# Altium schematic sheet Ports.SchDoc
size A4
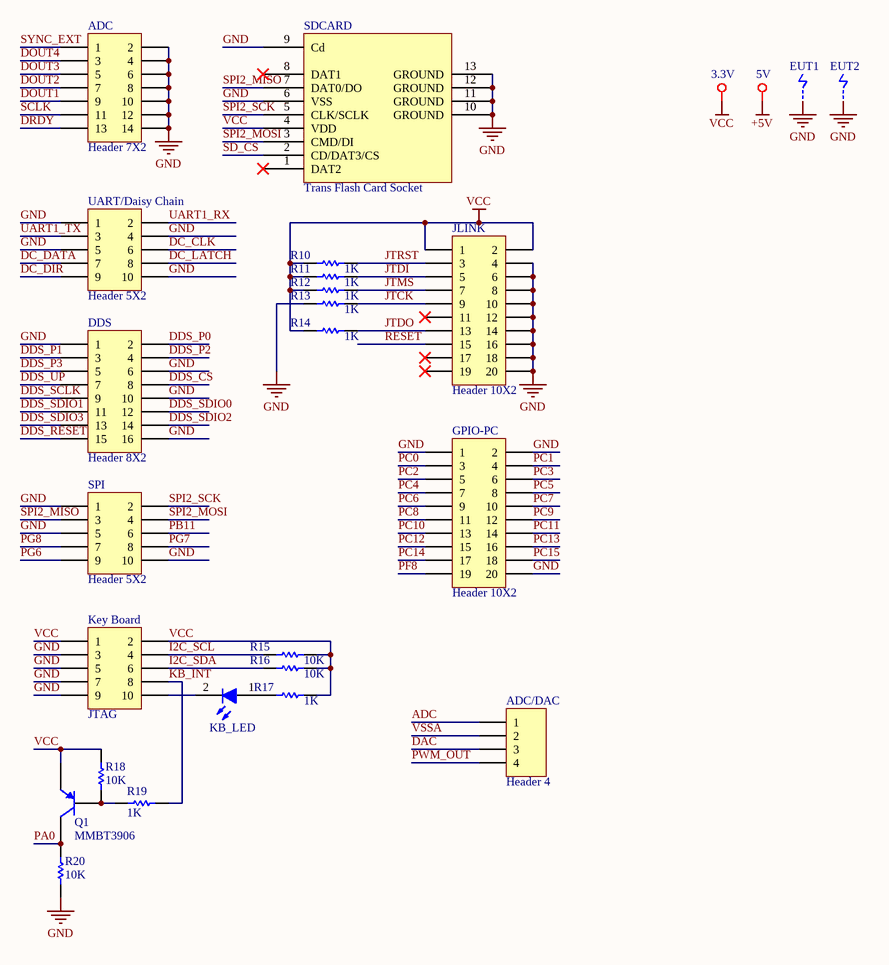
[diagram p0: Ports.SchDoc]

## Parts
3.3V  TestPoint  [TestHole]  (value not drawn)
5V  TestPoint  [TestHole]  (value not drawn)
ADC  Header 7X2  [HEADER7X2]
ADC/DAC  Header 4  [HDR1X4]
DDS  Header 8X2  [HEADER8X2]
EUT1  EUT  [EUT]  (value not drawn)
EUT2  EUT  [EUT]  (value not drawn)
GPIO-PC  Header 10X2  [HEADER 10X2]
JLINK  Header 10X2  [HEADER 10X2]
KB_LED  LED-BLUE  [0603LED_BLUE_V]  (value not drawn)
Key_Board  JTAG  [HEADER5X2]
Q1  MMBT3906  [SOT23_M]
R10  1K  [RESC0603(1608)_M]
R11  1K  [RESC0603(1608)_M]
R12  1K  [RESC0603(1608)_M]
R13  1K  [RESC0603(1608)_M]
R14  1K  [RESC0603(1608)_M]
R15  10K  [RESC0603(1608)_M]
R16  10K  [RESC0603(1608)_M]
R17  1K  [RESC0603(1608)_M]
R18  10K  [RESC0603(1608)_M]
R19  1K  [RESC0603(1608)_M]
R20  10K  [RESC0603(1608)_M]
SDCARD  Trans Flash Card Socket  [TF Card]
SPI  Header 5X2  [HEADER5X2]
UART/Daisy_Chain  Header 5X2  [HEADER5X2]

## Nets
+5V: 5V.1
GND: ADC.2 ADC.4 ADC.6 ADC.8 ADC.10 ADC.12 ADC.14 DDS.1 DDS.6 DDS.10 DDS.16 EUT1.2 EUT2.2 GPIO-PC.1 GPIO-PC.2 GPIO-PC.20 JLINK.4 JLINK.6 JLINK.8 JLINK.10 JLINK.12 JLINK.14 JLINK.16 JLINK.18 JLINK.20 Key_Board.3 Key_Board.5 Key_Board.7 Key_Board.9 R13.1 R20.1 SDCARD.6(VSS) SDCARD.9(Cd) SDCARD.10(GROUND) SDCARD.11(GROUND) SDCARD.12(GROUND) SDCARD.13(GROUND) SPI.1 SPI.5 SPI.10 UART/Daisy_Chain.1 UART/Daisy_Chain.4 UART/Daisy_Chain.5 UART/Daisy_Chain.10
VCC: 3.3V.1 JLINK.1 JLINK.2 Key_Board.1 Key_Board.2 Q1.2(E) R10.1 R11.1 R12.1 R14.1 R15.2 R16.2 R17.2 R18.2 SDCARD.4(VDD)
ADC: ADC/DAC.1
DAC: ADC/DAC.3
DC_CLK: UART/Daisy_Chain.6
DC_DATA: UART/Daisy_Chain.7
DC_DIR: UART/Daisy_Chain.9
DC_LATCH: UART/Daisy_Chain.8
DDS_CS: DDS.8
DDS_P0: DDS.2
DDS_P1: DDS.3
DDS_P2: DDS.4
DDS_P3: DDS.5
DDS_RESET: DDS.15
DDS_SCLK: DDS.9
DDS_SDIO0: DDS.12
DDS_SDIO1: DDS.11
DDS_SDIO2: DDS.14
DDS_SDIO3: DDS.13
DDS_UP: DDS.7
DOUT1: ADC.9
DOUT2: ADC.7
DOUT3: ADC.5
DOUT4: ADC.3
DRDY: ADC.13
I2C_SCL: Key_Board.4 R15.1
I2C_SDA: Key_Board.6 R16.1
JTCK: JLINK.9 R13.2
JTDI: JLINK.5 R11.2
JTDO: JLINK.13 R14.2
JTMS: JLINK.7 R12.2
JTRST: JLINK.3 R10.2
KB_INT: Key_Board.8 R19.2
PA0: Q1.3(C) R20.2
PB11: SPI.6
PC0: GPIO-PC.3
PC1: GPIO-PC.4
PC2: GPIO-PC.5
PC3: GPIO-PC.6
PC4: GPIO-PC.7
PC5: GPIO-PC.8
PC6: GPIO-PC.9
PC7: GPIO-PC.10
PC8: GPIO-PC.11
PC9: GPIO-PC.12
PC10: GPIO-PC.13
PC11: GPIO-PC.14
PC12: GPIO-PC.15
PC13: GPIO-PC.16
PC14: GPIO-PC.17
PC15: GPIO-PC.18
PF8: GPIO-PC.19
PG6: SPI.9
PG7: SPI.8
PG8: SPI.7
PWM_OUT: ADC/DAC.4
RESET: JLINK.15
SCLK: ADC.11
SD_CS: SDCARD.2(CD/DAT3/CS)
SPI2_MISO: SDCARD.7(DAT0/DO) SPI.3
SPI2_MOSI: SDCARD.3(CMD/DI) SPI.4
SPI2_SCK: SDCARD.5(CLK/SCLK) SPI.2
SYNC_EXT: ADC.1
UART1_RX: UART/Daisy_Chain.2
UART1_TX: UART/Daisy_Chain.3
VSSA: ADC/DAC.2
NetKB_LED_1: KB_LED.1(A) R17.1
NetKB_LED_2: KB_LED.2(K) Key_Board.10
NetQ1_1: Q1.1(B) R18.1 R19.1

Not connected (* = marked no-connect by the designer): JLINK 11* 17* 19*; SDCARD 1(DAT2)* 8(DAT1)*

## Library data of the parts
ADC = Header 7X2: Header, 7-Pin, Dual row; LatestRevisionDate: 17-Jul-2002; LatestRevisionNote: Re-released for DXP Platform.; Publisher: Altium Limited
ADC/DAC = Header 4: Header, 4-Pin; LatestRevisionDate: 17-Jul-2002; LatestRevisionNote: Re-released for DXP Platform.; Publisher: Altium Limited
DDS = Header 8X2: Header, 8-Pin, Dual row; LatestRevisionDate: 17-Jul-2002; LatestRevisionNote: Re-released for DXP Platform.; Publisher: Altium Limited
GPIO-PC JLINK = Header 10X2: Header, 10-Pin, Dual row; LatestRevisionDate: 17-Jul-2002; LatestRevisionNote: Re-released for DXP Platform.; Publisher: Altium Limited
Key_Board = Header 5X2: Header, 5-Pin, Dual row; Manufacturer: Generic Components; Class: Connector
Q1 = MMBT3906: PNP General Purpose Amplifier; Published: 8-Jun-2000; LatestRevisionDate: 15-Jan-2003; LatestRevisionNote: PCB Footprint 'BCY-W3/D4.7' replaced; DatasheetVersion: 1997; PackageVersion: Sep-1998; PackageReference: TO-92A; Publisher: Altium Limited; PackageDescription: TO, Flat Index; 3 In-Line, Axial Leads; Body Dia. 4.5mm; Leads 0.51 x 0.48 mm (max); ComponentLink1Description: Manufacturer Link; ComponentLink1URL: http://www.fairchildsemi.com/; ComponentLink2Description: Datasheet; ComponentLink2URL: http://www.fairchildsemi.com/ds/2N%2F2N3906.pdf
R10-R20 = RES
SDCARD = Trans Flash Card
SPI UART/Daisy_Chain = Header 5X2: Header, 5-Pin, Dual row; LatestRevisionDate: 17-Jul-2002; LatestRevisionNote: Re-released for DXP Platform.; Publisher: Altium Limited